# Altium schematic sheet Gero_Board2.SchDoc
size B; SheetNumber: 3; SheetTotal: 3
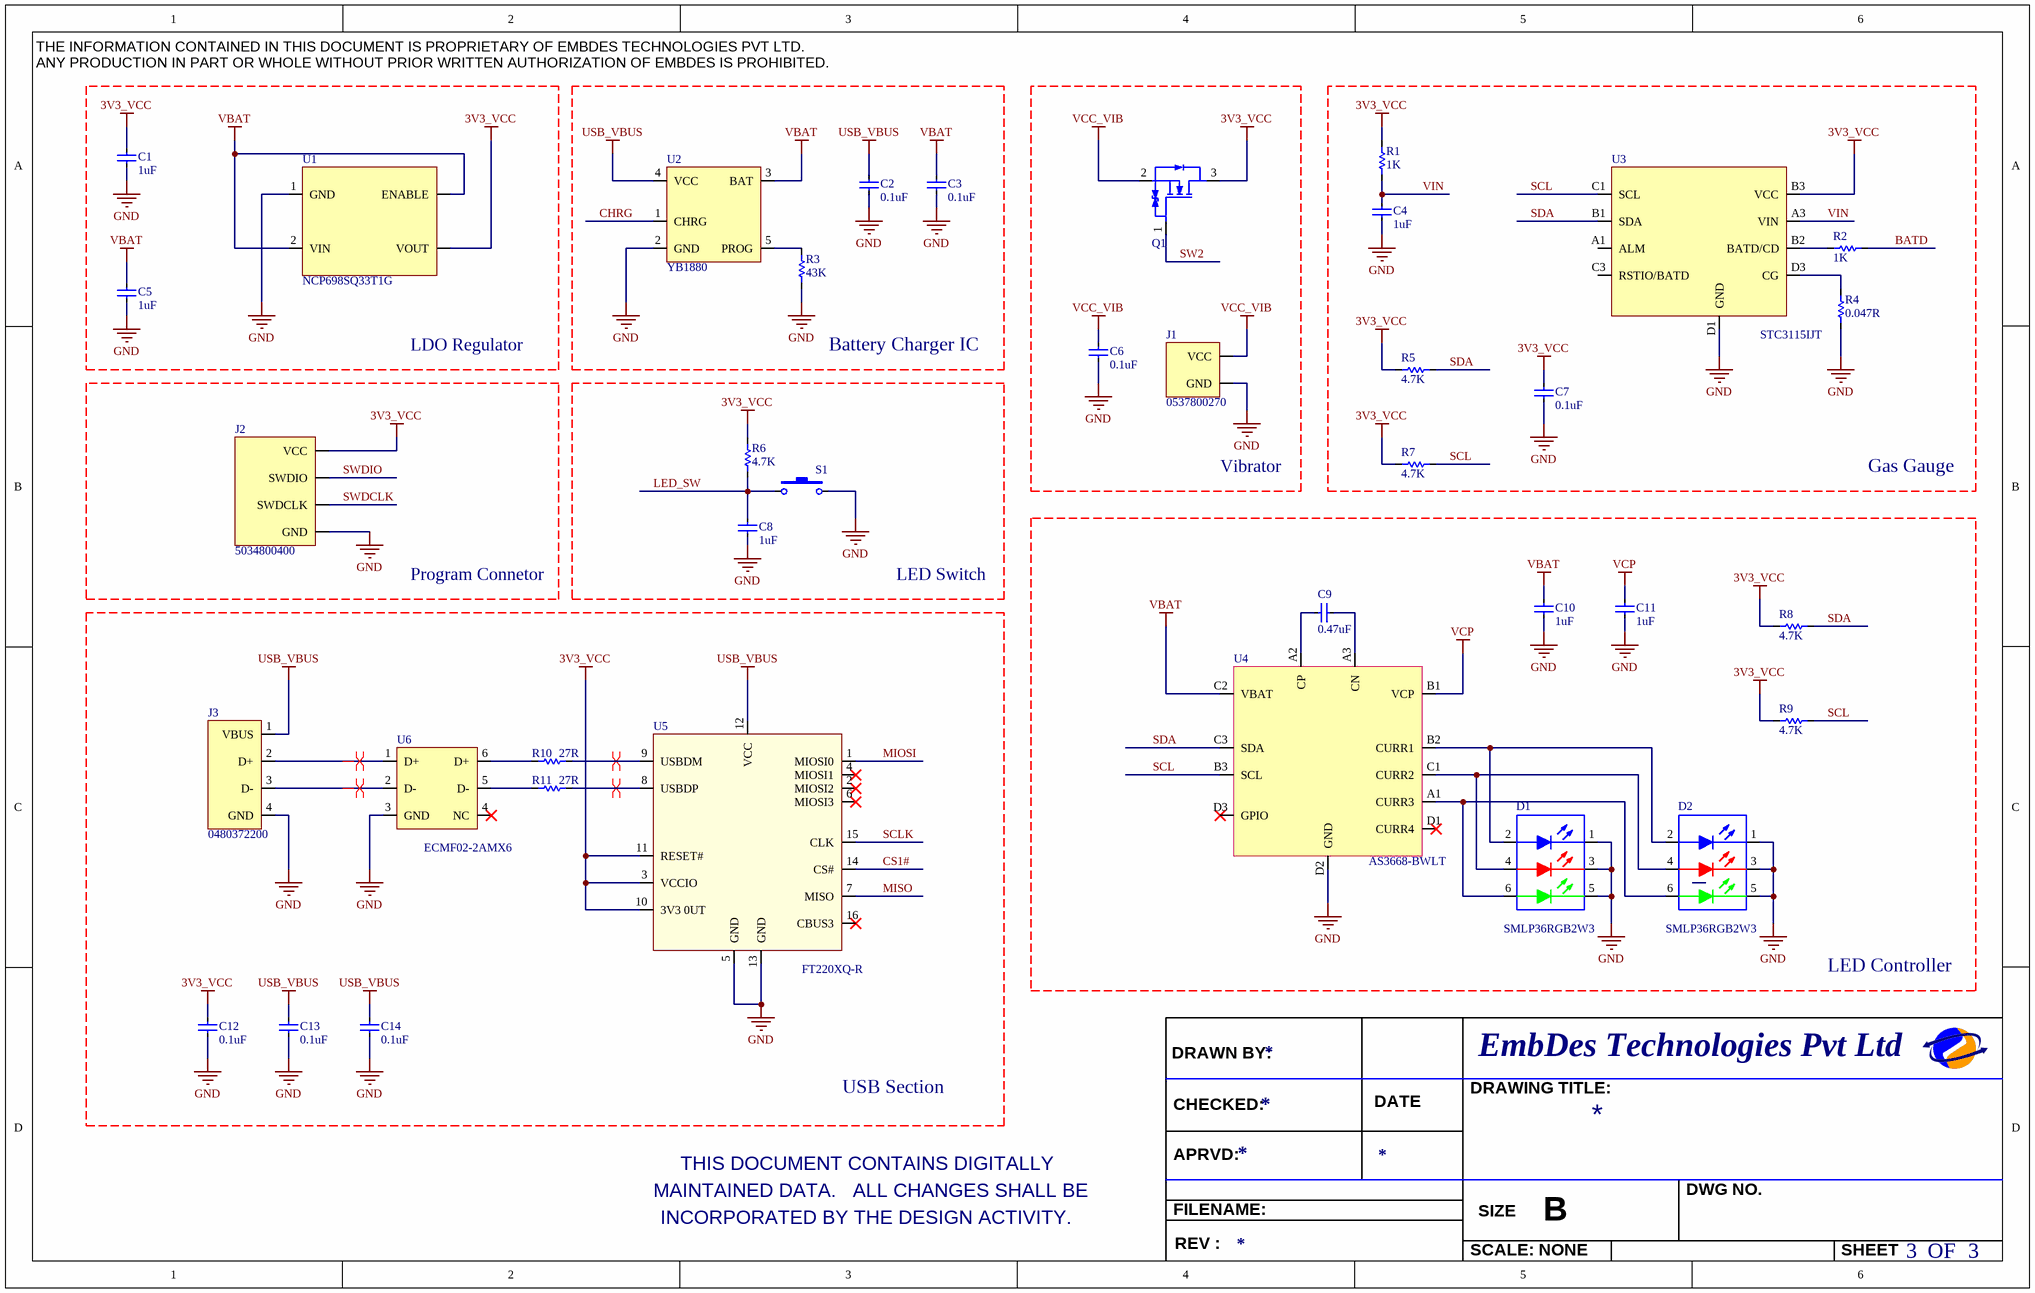
[diagram p0: Gero_Board2.SchDoc]

## Parts
C1  value 1uF  [CAPC1005X04L]  (hidden comment: CAP CER 1UF 16V 10% X5R 0402)
C2  value 0.1uF  [CAPC1005X04L]  (hidden comment: CAP CER 0.1UF 16V 10% X5R 0201)
C3  value 0.1uF  [CAPC1005X04L]  (hidden comment: CAP CER 0.1UF 16V 10% X5R 0201)
C4  value 1uF  [CAPC1005X04L]  (hidden comment: CAP CER 1UF 16V 10% X5R 0402)
C5  value 1uF  [CAPC1005X04L]  (hidden comment: CAP CER 1UF 16V 10% X5R 0402)
C6  value 0.1uF  [CAPC1005X04L]  (hidden comment: CAP CER 0.1UF 16V 10% X5R 0201)
C7  value 0.1uF  [CAPC1005X04L]  (hidden comment: CAP CER 0.1UF 16V 10% X5R 0201)
C8  value 1uF  [CAPC1005X04L]  (hidden comment: CAP CER 1UF 16V 10% X5R 0402)
C9  value 0.47uF  [CAPC1005X04L]  (hidden comment: CAP CER 0.47UF 10V 20% JB 0201)
C10  value 1uF  [CAPC1005X04L]  (hidden comment: CAP CER 1UF 16V 10% X5R 0402)
C11  value 1uF  [CAPC1005X04L]  (hidden comment: CAP CER 1UF 16V 10% X5R 0402)
C12  value 0.1uF  [CAPC1005X04L]  (hidden comment: CAP CER 0.1UF 16V 10% X5R 0201)
C13  value 0.1uF  [CAPC1005X04L]  (hidden comment: CAP CER 0.1UF 16V 10% X5R 0201)
C14  value 0.1uF  [CAPC1005X04L]  (hidden comment: CAP CER 0.1UF 16V 10% X5R 0201)
D1  Manufacturer Part Number: SMLP36RGB2W3  [VLMG1300-GS08]  (hidden comment: LED PICOLED RGB 5MA 1510)
D2  Manufacturer Part Number: SMLP36RGB2W3  [VLMG1300-GS08]  (hidden comment: LED PICOLED RGB 5MA 1510)
J1  Manufacturer Part Number: 0537800270  (hidden comment: CONN HEADER 2POS 1.25MM R/A SMD)
J2  Manufacturer Part Number: 5034800400  (hidden comment: CONN .5MM FPC 4POS RA SMD B-FLIP)
J3  Manufacturer Part Number: 0480372200  (hidden comment: CONN PLUG USB A 4POS SMD R/A)
Q1  MOSFET N-CH 20V 200MA 3-DFN  (value not drawn)
R1  value 1K  [R0402]  (hidden comment: RES 1K OHM 1/20W 1% 0201 SMD)
R2  value 1K  [R0402]  (hidden comment: RES 1K OHM 1/20W 1% 0201 SMD)
R3  value 43K  [R0402]  (hidden comment: RES 43K OHM 1/20W 1% 0201 SMD)
R4  value 0.047R  [R0402]  (hidden comment: RES 0.047 OHM 1/4W 1% 0402 SMD)
R5  value 4.7K  [R0402]  (hidden comment: RES 4.7K OHM 1/20W 1% 0201 SMD)
R6  value 4.7K  [R0402]  (hidden comment: RES 4.7K OHM 1/20W 1% 0201 SMD)
R7  value 4.7K  [R0402]  (hidden comment: RES 4.7K OHM 1/20W 1% 0201 SMD)
R8  value 4.7K  [R0402]  (hidden comment: RES 4.7K OHM 1/20W 1% 0201 SMD)
R9  value 4.7K  [R0402]  (hidden comment: RES 4.7K OHM 1/20W 1% 0201 SMD)
R10  value 27R  [R0402]  (hidden comment: RES 27 OHM 1/20W 1% 0201 SMD)
R11  value 27R  [R0402]  (hidden comment: RES 27 OHM 1/20W 1% 0201 SMD)
S1  SW-PB  (value not drawn)
U1  Manufacturer Part Number: NCP698SQ33T1G  (hidden comment: IC REG LDO 3.3V 0.28A SC82AB)
U2  Manufacturer Part Number: YB1880  [YB1880ST25P]  (hidden comment: Standalone Linear Lithium Battery Charger)
U3  Manufacturer Part Number: STC3115IJT  [STC3115]  (hidden comment: IC GAS GAUGE LI-ION/POL 10CSP)
U4  Manufacturer Part Number: AS3668-BWLT  [AS3668  CSP 1.3x1.7mm]  (hidden comment: 4 Channel Breathlight Controller)
U5  Manufacturer Part Number: FT220XQ-R  [FT220 XQ-R]  (hidden comment: IC USB 4 BIT SPI/FT1248 16QFN)
U6  Manufacturer Part Number: ECMF02-2AMX6  (hidden comment: IC ESD FILTER COMM MODE 6-UQFN)

## Nets
3V3_VCC: C1.2 C7.2 C12.2 J2.1(VCC) Q1.3(D) R1.2 R5.1 R6.2 R7.1 R8.1 R9.1 U1.4(VOUT) U3.B3(VCC) U5.3(VCCIO) U5.10(3V3_0UT) U5.11(RESET#)
GND: C1.1 C2.1 C3.1 C4.2 C5.1 C6.1 C7.1 C8.1 C10.1 C11.1 C12.1 C13.1 C14.1 D1.1(K) D1.3(K) D1.5(K) D2.1(K) D2.3(K) D2.5(K) J1.2(GND) J2.4(GND) J3.4(GND) R3.1 R4.1 S1.2 U1.1(GND) U2.2(GND) U3.D1(GND) U4.D2(GND) U5.5(GND) U5.13(GND) U6.3(GND)
USB_VBUS: C2.2 C13.2 C14.2 J3.1(VBUS) U2.4(VCC) U5.12(VCC)
VBAT: C3.2 C5.2 C10.2 U1.2(VIN) U1.3(ENABLE) U2.3(BAT) U4.C2(VBAT)
VCC_VIB: C6.2 J1.1(VCC) Q1.2(S)
VCP: C11.2 U4.B1(VCP)
BATD: R2.1
CHRG: U2.1(CHRG)
CS1#: U5.14(CS#)
LED_SW: C8.2 R6.1 S1.1
MIOSI: U5.1(MIOSI0)
MISO: U5.7(MISO)
SCL: R7.2 R9.2 U3.C1(SCL) U4.B3(SCL)
SCLK: U5.15(CLK)
SDA: R5.2 R8.2 U3.B1(SDA) U4.C3(SDA)
SW2: Q1.1(G)
SWDCLK: J2.3(SWDCLK)
SWDIO: J2.2(SWDIO)
VIN: C4.1 R1.1 U3.A3(VIN)
NetC9_1: C9.1 U4.A2(CP)
NetC9_2: C9.2 U4.A3(CN)
NetD1_2: D1.2(A) D2.2(A) U4.B2(CURR1)
NetD1_4: D1.4(A) D2.4(A) U4.C1(CURR2)
NetD1_6: D1.6(A) D2.6(A) U4.A1(CURR3)
NetJ3_2: J3.2(D+) U6.1(D+)
NetJ3_3: J3.3(D-) U6.2(D-)
NetR2_2: R2.2 U3.B2(BATD/CD)
NetR3_2: R3.2 U2.5(PROG)
NetR4_2: R4.2 U3.D3(CG)
NetR10_1: R10.1 U6.6(D+)
NetR10_2: R10.2 U5.9(USBDM)
NetR11_1: R11.1 U6.5(D-)
NetR11_2: R11.2 U5.8(USBDP)

Not connected (* = marked no-connect by the designer): U3 A1(ALM) C3(RSTIO/BATD); U4 D1(CURR4)* D3(GPIO)*; U5 2(MIOSI2)* 4(MIOSI1)* 6(MIOSI3)* 16(CBUS3)*; U6 4(NC)*

## Layout directives
differential pair: NetJ3_2, NetJ3_3, NetR10_2, NetR11_2

## Notes on the sheet
- LDO Regulator
- Battery Charger IC
- Vibrator
- Gas Gauge
- Program Connetor
- LED Switch
- LED Controller
- USB Section
- THE INFORMATION CONTAINED IN THIS DOCUMENT IS PROPRIETARY OF EMBDES TECHNOLOGIES PVT LTD.
  ANY PRODUCTION IN PART OR WHOLE WITHOUT PRIOR WRITTEN AUTHORIZATION OF EMBDES IS PROHIBITED.
- DRAWN BY:
- CHECKED:
- DATE
- DRAWING TITLE:
- EmbDes Technologies Pvt Ltd
- THIS DOCUMENT CONTAINS DIGITALLY
- APRVD:
- MAINTAINED DATA.   ALL CHANGES SHALL BE
- INCORPORATED BY THE DESIGN ACTIVITY.
- FILENAME:
- SIZE
- B
- DWG NO.
- REV :
- SCALE: NONE
- SHEET
- OF

## Library data of the parts
C1 C4 C5 C8 C10 C11 = CAP CER 1UF 16V 10% X5R 0402: Manufacturer: TDK Corporation; Manufacturer Part Number: C1005X5R1C105K050BC; Note: 16V
C2 C3 C6 C7 C12-C14 = CAP CER 0.1UF 16V 10% X5R 0201: Manufacturer: TDK Corporation; Manufacturer Part Number: C0603X5R1C104K030BC; Voltage: 16V
C9 = CAP CER 0.47UF 10V 20% JB 0201: Manufacturer: TDK Corporation; Manufacturer Part Number: C0603JB1A474M030BC; Voltage: 10V
D1 D2 = LED PICOLED RGB 5MA 1510: Manufacturer: Rohm Semiconductor
J1 = CONN HEADER 2POS 1.25MM R/A SMD: Manufacturer: Molex Inc
J2 = CONN .5MM FPC 4POS RA SMD B-FLIP: Manufacturer: Molex Inc
J3 = CONN PLUG USB A 4POS SMD R/A: Manufacturer: Molex Inc
Q1 = MOSFET N-CH 20V 200MA 3-DFN: MANUFACTURER: Diodes Inc; MFG PART NO: DMN2005LP4K-7
R1 R2 = RES 1K OHM 1/20W 1% 0201 SMD: Manufacturer Part Number_1: ERJ-1GEF1001C; Manufacturer_1: Panasonic Electronic Components; Package: R0201
R3 = RES 43K OHM 1/20W 1% 0201 SMD: Manufacturer Part Number: ERJ-1GEF4302C; Manufacturer: Panasonic Electronic Components; Package: R0402
R4 = RES 0.047 OHM 1/4W 1% 0402 SMD: Manufacturer Part Number_1: ERJ-2BWFR047X; Manufacturer_1: Panasonic Electronic Components; Package: R0402
R5-R9 = RES 4.7K OHM 1/20W 1% 0201 SMD: Manufacturer Part Number_1: ERJ-1GEF4701C; Manufacturer: Panasonic Electronic Components; Package: R0201
R10 R11 = RES 27 OHM 1/20W 1% 0201 SMD: Manufacturer Part Number: ERJ-1GEF27R0C; Manufacturer: Panasonic Electronic Components; Package: R0201
S1 = SW-PB: Switch; Manufacturer: *; Manufacturer Part No: *
U1 = IC REG LDO 3.3V 0.28A SC82AB: Manufacturer: ON Semiconductor
U2 = Standalone Linear Lithium Battery Charger: Manufacturer: YOBON TECHNOLOGIES; Package Type: SOT23-5
U3 = IC GAS GAUGE LI-ION/POL 10CSP: Manufacturer: STMicroelectronics
U4 = 4 Channel Breathlight Controller: Manufacturer: AMS
U5 = IC USB 4 BIT SPI/FT1248 16QFN: Manufacturer: FTDI, Future Technology Devices International Ltd; Package: 16-WQFN
U6 = IC ESD FILTER COMM MODE 6-UQFN: Manufacturer: STMicroelectronics